# Altium schematic sheet 10-power.SchDoc: Power
size Letter; DrawnBy: J. Brinton; Engineer: J. Brinton; Revision: 1; SheetNumber: 10; SheetTotal: 14
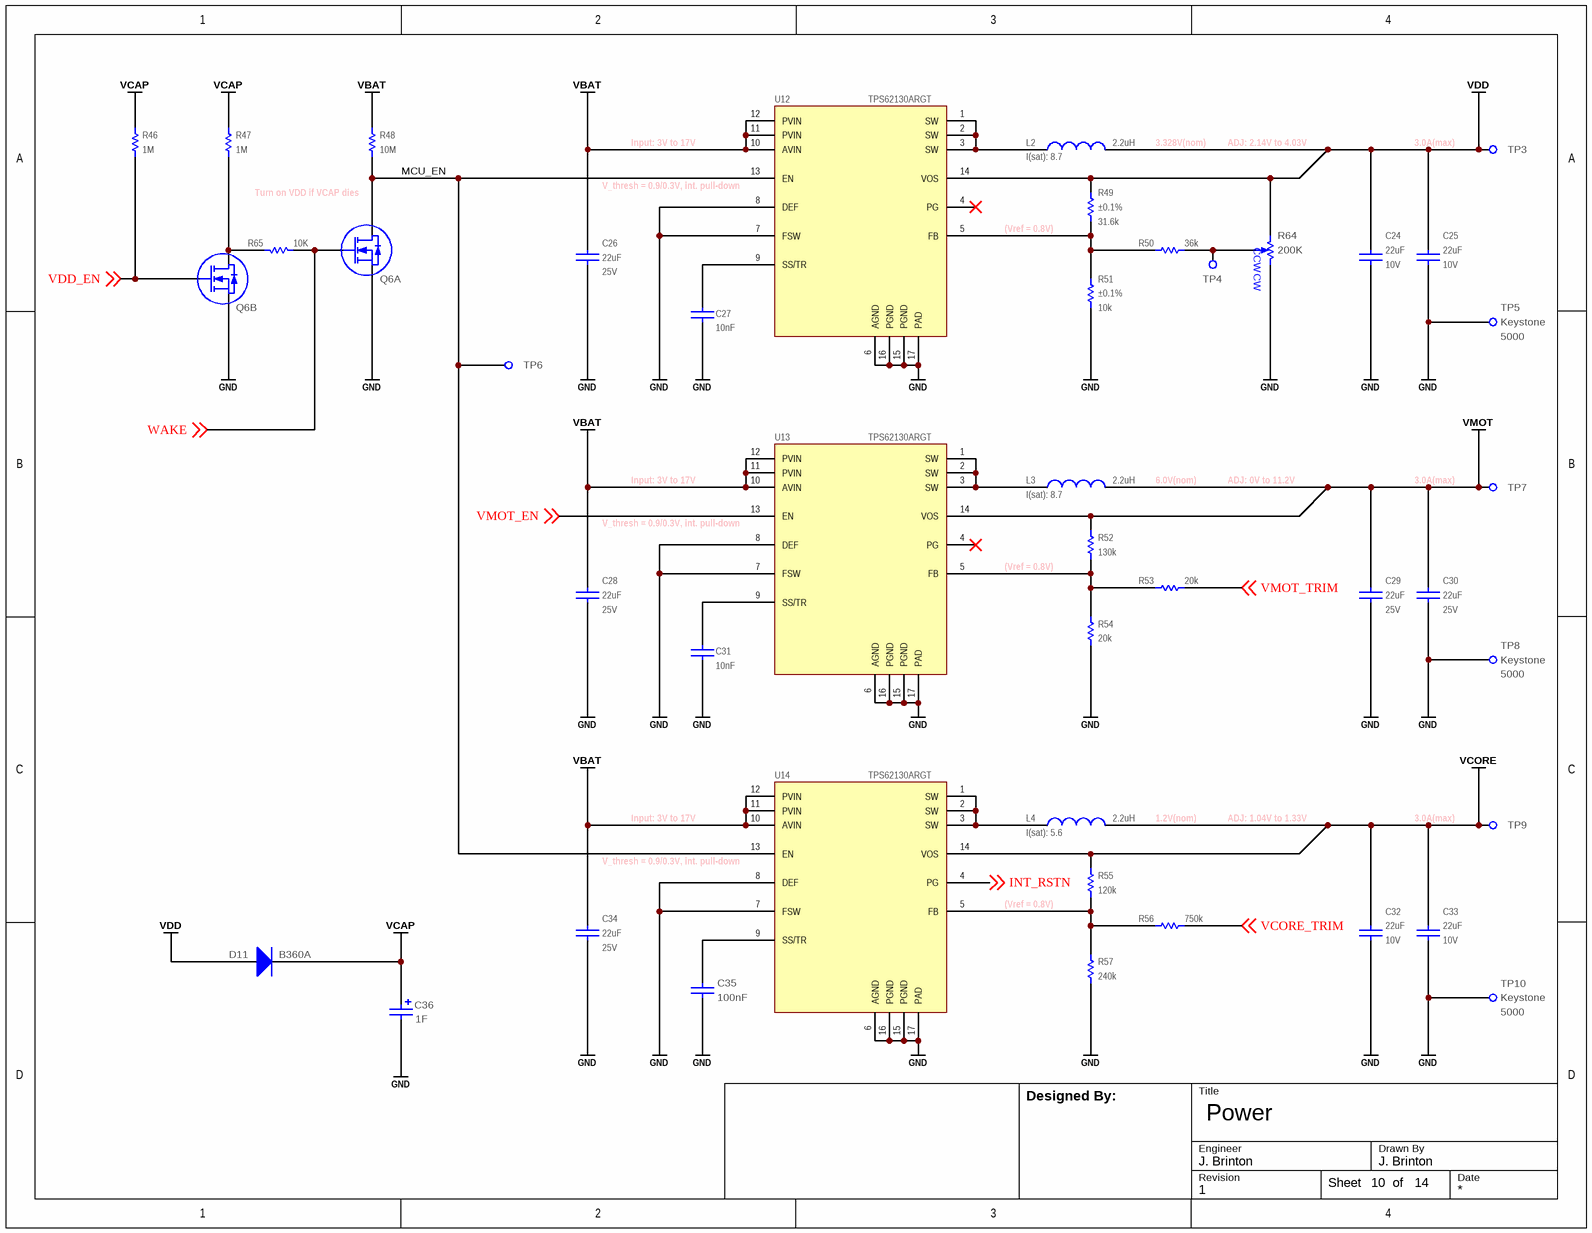
[diagram p0: 10-power.SchDoc]

## Parts
C24  value 22uF  Voltage: 10V  [CAPC200X125X145L45N]  (hidden comment: C2012X7S1A226M125)
C25  value 22uF  Voltage: 10V  [CAPC200X125X145L45N]  (hidden comment: C2012X7S1A226M125)
C26  value 22uF  Voltage: 25V  [CAPC320X250X270L50N]  (hidden comment: GRM32ER71E226KE15)
C27  value 10nF  [CAPC100X50X55L25N]  (hidden comment: GRM155R71H103KA88)
C28  value 22uF  Voltage: 25V  [CAPC320X250X270L50N]  (hidden comment: GRM32ER71E226KE15)
C29  value 22uF  Voltage: 25V  [CAPC320X250X270L50N]  (hidden comment: GRM32ER71E226KE15)
C30  value 22uF  Voltage: 25V  [CAPC320X250X270L50N]  (hidden comment: GRM32ER71E226KE15)
C31  value 10nF  [CAPC100X50X55L25N]  (hidden comment: GRM155R71H103KA88)
C32  value 22uF  Voltage: 10V  [CAPC200X125X145L45N]  (hidden comment: C2012X7S1A226M125)
C33  value 22uF  Voltage: 10V  [CAPC200X125X145L45N]  (hidden comment: C2012X7S1A226M125)
C34  value 22uF  Voltage: 25V  [CAPC320X250X270L50N]  (hidden comment: GRM32ER71E226KE15)
C35  value 100nF  [CAPC200X125X145L45N]  (hidden comment: GCM21BR71H104KA37L)
C36  value 1F  [DBJ-5R5D105T]  (hidden comment: CAP_POL)
D11  B360A  [SMA]
L2  value 2.2uH  I(sat): 8.7  [XAL5030]  (hidden comment: XAL5030-332ME)
L3  value 2.2uH  I(sat): 8.7  [XAL5030]  (hidden comment: XAL5030-332ME)
L4  value 2.2uH  I(sat): 5.6  [XFL4020]  (hidden comment: XAL4020-222ME_)
Q6  2N7002DWQ-7-F  [SOT363]  (value not drawn)  (parts A,B of 2)
R46  value 1M  [RESC2012X70N]  (hidden comment: ERJ-6ENF1004V)
R47  value 1M  [RESC2012X70N]  (hidden comment: ERJ-6ENF1004V)
R48  value 10M  [RESC2012X70N]  (hidden comment: ERJ-6GEYJ106V)
R49  value 31.6k  Tolerance: ±0.1%  [RESC2012X70N]  (hidden comment: ERA-6AEB3162V)
R50  value 36k  [RESC2012X70N]  (hidden comment: ERJ-6ENF3602V)
R51  value 10k  Tolerance: ±0.1%  [RESC2012X70N]  (hidden comment: ERA-6AEB103V)
R52  value 130k  [RESC2012X70N]  (hidden comment: ERJ-6ENF1303V)
R53  value 20k  [RESC2012X70N]  (hidden comment: ERJ-6ENF2002V)
R54  value 20k  [RESC2012X70N]  (hidden comment: ERJ-6ENF2002V)
R55  value 120k  [RESC2012X70N]  (hidden comment: ERJ-6ENF1203V)
R56  value 750k  [RESC2012X70N]  (hidden comment: ERJ-6ENF7502V)
R57  value 240k  [RESC2012X70N]  (hidden comment: ERJ-6ENF2403V)
R64  value 200K  [PVG3A]  (hidden comment: PVG3A204C01R00)
R65  value 10K  [RESC2012X70N]  (hidden comment: ERJ-6ENF1002V)
TP3  TEST_POINT_SMD_50  [TEST_POINT_SMD_50]  (value not drawn)  (no BOM)
TP4  TEST_POINT_SMD_50  [TEST_POINT_SMD_50]  (value not drawn)  (no BOM)
TP5  5000  Manufacturer: Keystone  [TEST_POINT]
TP6  TEST_POINT_SMD_50  [TEST_POINT_SMD_50]  (value not drawn)  (no BOM)
TP7  TEST_POINT_SMD_50  [TEST_POINT_SMD_50]  (value not drawn)  (no BOM)
TP8  5000  Manufacturer: Keystone  [TEST_POINT]
TP9  TEST_POINT_SMD_50  [TEST_POINT_SMD_50]  (value not drawn)  (no BOM)
TP10  5000  Manufacturer: Keystone  [TEST_POINT]
U12  TPS62130ARGT  [S-PQFP-8N]
U13  TPS62130ARGT  [S-PQFP-8N]
U14  TPS62130ARGT  [S-PQFP-8N]

## Nets
GND: C24.1 C25.1 C26.1 C27.2 C28.1 C29.1 C30.1 C31.2 C32.1 C33.1 C34.1 C35.2 C36.2 Q6.1(S2) Q6.4(S1) R51.1 R54.1 R57.1 R64.3(CW) TP5.1 TP8.1 TP10.1 U12.6(AGND) U12.7(FSW) U12.8(DEF) U12.15(PGND) U12.16(PGND) U12.17(PAD) U13.6(AGND) U13.7(FSW) U13.8(DEF) U13.15(PGND) U13.16(PGND) U13.17(PAD) U14.6(AGND) U14.7(FSW) U14.8(DEF) U14.15(PGND) U14.16(PGND) U14.17(PAD)
VBAT: C26.2 C28.2 C34.2 R48.2 U12.10(AVIN) U12.11(PVIN) U12.12(PVIN) U13.10(AVIN) U13.11(PVIN) U13.12(PVIN) U14.10(AVIN) U14.11(PVIN) U14.12(PVIN)
VCAP: C36.1 D11.2(K) R46.2 R47.2
VCORE: C32.2 C33.2 L4.2 R55.2 TP9.1 U14.14(VOS)
VDD: C24.2 C25.2 D11.1(A) L2.2 R49.2 R64.1(CCW) TP3.1 U12.14(VOS)
VMOT: C29.2 C30.2 L3.2 R52.2 TP7.1 U13.14(VOS)
INT_RSTN: U14.4(PG) ; off-sheet INT_RSTN
MCU_EN: Q6.3(D1) R48.1 TP6.1 U12.13(EN) U14.13(EN)
VCORE_TRIM: R56.1 ; off-sheet VCORE_TRIM
VDD_EN: Q6.2(G2) R46.1 ; off-sheet VDD_EN
VMOT_EN: U13.13(EN) ; off-sheet VMOT_EN
VMOT_TRIM: R53.1 ; off-sheet VMOT_TRIM
WAKE: Q6.5(G1) R65.1 ; off-sheet WAKE
NetC27_1: C27.1 U12.9(SS/TR)
NetC31_1: C31.1 U13.9(SS/TR)
NetC35_1: C35.1 U14.9(SS/TR)
NetL2_1: L2.1 U12.1(SW) U12.2(SW) U12.3(SW)
NetL3_1: L3.1 U13.1(SW) U13.2(SW) U13.3(SW)
NetL4_1: L4.1 U14.1(SW) U14.2(SW) U14.3(SW)
NetQ6_6: Q6.6(D2) R47.1 R65.2
NetR49_1: R49.1 R50.2 R51.2 U12.5(FB)
NetR50_1: R50.1 R64.2(CT) TP4.1
NetR52_1: R52.1 R53.2 R54.2 U13.5(FB)
NetR55_1: R55.1 R56.2 R57.2 U14.5(FB)

Not connected (* = marked no-connect by the designer): U12 4(PG)*; U13 4(PG)*

## Notes on the sheet
- Input: 3V to 17V
- 3.328V(nom)
- ADJ: 2.14V to 4.03V
- (near TP3) 3.0A(max)
- Turn on VDD if VCAP dies
- (near U12) V_thresh = 0.9/0.3V, int. pull-down
- (near R49) (Vref = 0.8V)
- (near U13) V_thresh = 0.9/0.3V, int. pull-down
- 6.0V(nom)
- ADJ: 0V to 11.2V
- (near TP7) 3.0A(max)
- (near R52) (Vref = 0.8V)
- 1.2V(nom)
- ADJ: 1.04V to 1.33V
- (near TP9) 3.0A(max)
- (near U14) V_thresh = 0.9/0.3V, int. pull-down
- (near R55) (Vref = 0.8V)
- Designed By:
- Title
- Engineer
- Revision
- Drawn By
- Date
- Sheet
- of

## Library data of the parts
C24 C25 C32 C33 = CAP: Ceramic Capacitor 22uF ±20% 10V X7S 0805; Manufacturer: TDK; Tr: -55:125; Manufacturer P/N: C2012X7S1A226M125; Tolerance: ±20%; Package: 0805
C26 C28-C30 C34 = CAP: Ceramic Capacitor 22uF ±10% 25V X7R 1210; Manufacturer: Murata; Tr: -55:125; Manufacturer P/N: GRM32ER71E226KE15; Tolerance: ±10%; Package: 1210
C27 C31 = CAP: Ceramic Capacitor 10nF ±10% 50V X7R 0402; Manufacturer: Murata; Tr: -55:125; Manufacturer P/N: GRM155R71H103KA88; Tolerance: ±10%; Voltage: 50V; Package: 0402
C35 = TMK212B7105KG: Ceramic Capacitor 100nF ±10% 50V X7R 0805; Manufacturer: Murata; Tr: -55:125; Manufacturer P/N: GCM21BR71H104KA37L; Tolerance: ±10%; Package: 0805; Voltage: 50V
C36 = CAP_POL: Super Capacitor 1F 5.5V Leaded; Manufacturer: Elna; Manufacturer P/N: DBJ-5R5D105T; Voltage: 5.5V
D11 = D360A: DIODE SCHOTTKY 60V 3A SMA; Manufacturer: Diodes Inc; Tr: -55:150; Manufacturer P/N: B360A; Current: 3A; Reverse Voltage (max): 60V; Package: SMA
L2 L3 = INDUCTOR: Shielded Power Inductor 2.2uH, 8.7A; Manufacturer: Coilcraft; Manufacturer P/N: XAL5030-332ME
L4 = INDUCTOR: Shielded Power Inductor 2.2uH, 5.6A; Manufacturer: Coilcraft; Manufacturer P/N: XAL4020-222ME
Q6 = 2N7002DW-7-F: Dual N-Channel Enhancement Mode MOSFET; Manufacturer: Diodes, Inc.; Tr: -55:150; Manufacturer P/N: 2N7002DWQ-7-F; Package: SOT363
R46 R47 = RES 0402: Thick Film Resistor 1M ±1% 0805; Manufacturer: Panasonic; Tr: -55:155; Package: 0805; Manufacturer P/N: ERJ-6ENF1004V; Tolerance: ±1%
R48 = RES 0402: Thick Film Resistor 10M ±1% 0805; Manufacturer: Panasonic; Tolerance: ±5%; Tr: -55:155; Package: 0805; Manufacturer P/N: ERJ-6GEYJ106V
R49 = RES: Thin Film Resistor 31.6k ±0.1% 0.125W 100V 0805; Manufacturer: Panasonic; Tcr: ±25; Tr: -55:155; Voltage: 100; Power: 0.125; Manufacturer P/N: ERA-6AEB3162V; Package: 0805
R50 = RES 0402: Thick Film Resistor 36k ±1% 0805; Manufacturer: Panasonic; Tr: -55:155; Package: 0805; Manufacturer P/N: ERJ-6ENF3602V; Tolerance: ±1%
R51 = RES: Thin Film Resistor 10k ±0.1% 0.125W 100V 0805; Manufacturer: Panasonic; Tcr: ±25; Tr: -55:155; Voltage: 100; Power: 0.125; Manufacturer P/N: ERA-6AEB103V; Package: 0805
R52 = RES 0402: Thick Film Resistor 130k ±1% 0805; Manufacturer: Panasonic; Tr: -55:155; Package: 0805; Manufacturer P/N: ERJ-6ENF1303V; Tolerance: ±1%
R53 R54 = RES 0402: Thick Film Resistor 20k ±1% 0805; Manufacturer: Panasonic; Tr: -55:155; Package: 0805; Manufacturer P/N: ERJ-6ENF2002V; Tolerance: ±1%
R55 = RES 0402: Thick Film Resistor 120k ±1% 0805; Manufacturer: Panasonic; Tr: -55:155; Package: 0805; Manufacturer P/N: ERJ-6ENF1203V; Tolerance: ±1%
R56 = RES 0402: Thick Film Resistor 750k ±1% 0805; Manufacturer: Panasonic; Tr: -55:155; Package: 0805; Manufacturer P/N: ERJ-6ENF7502V; Tolerance: ±1%
R57 = RES 0402: Thick Film Resistor 240k ±1% 0805; Manufacturer: Panasonic; Tr: -55:155; Package: 0805; Manufacturer P/N: ERJ-6ENF2403V; Tolerance: ±1%
R64 = PVG3A204C01R00: Trimmer 200K, sealed, cermet; Manufacturer: Murata; Manufacturer P/N: PVG3A204C01R00
R65 = RES 0402: Thick Film Resistor 10k ±1% 0805; Manufacturer: Panasonic; Tr: -55:155; Package: 0805; Manufacturer P/N: ERJ-6ENF1002V; Tolerance: ±1%
TP3 TP4 TP6 TP7 TP9 = TEST_POINT_SMD_50: Test Point SMD
TP5 TP8 TP10 = TEST_POINT: Thruhole Miniature Test Point; Manufacturer P/N: 5000; Do Not Place: *
U12-U14 = TPS62130RGT: 3-17V 3A Step-Down Converter VQFN; Manufacturer: Texas Instruments; Manufacturer P/N: TPS62130ARGT